# Altium project HW-FreestyleSensorLibre.PrjPcb
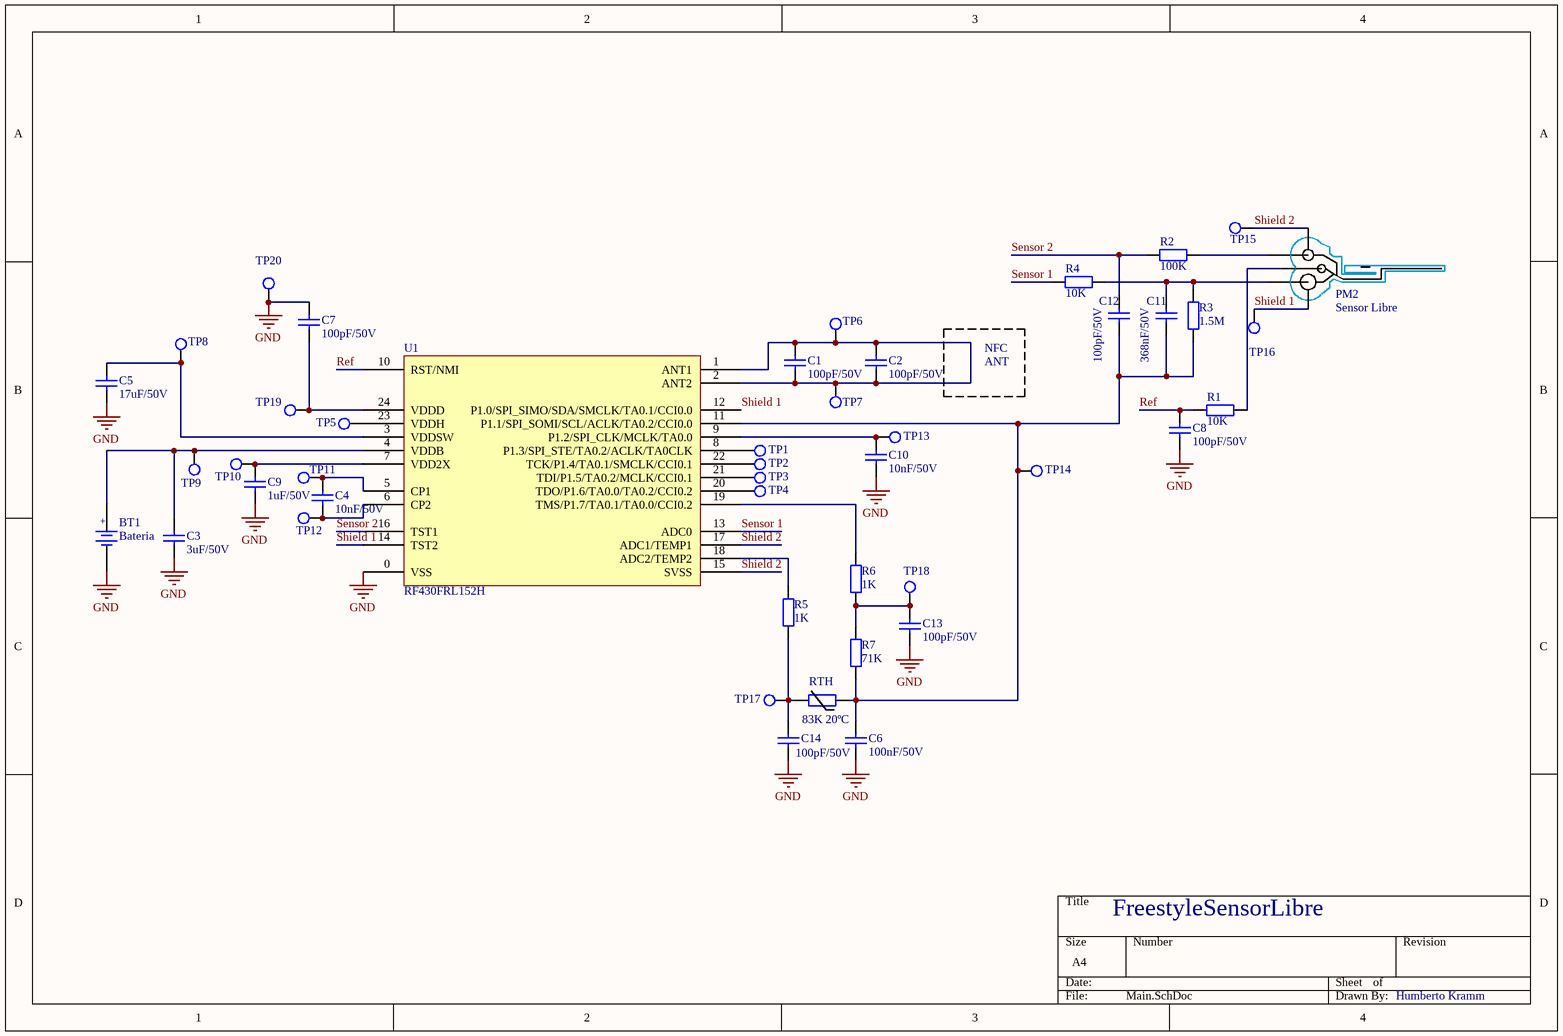
[diagram p0: Main.SchDoc]
1 sheet, 45 parts. Net scope: global (net labels, ports and power ports of the same name join across sheets).
Board file: ART23275-9 REV-A.PcbDoc

## Sheet Main.SchDoc: FreestyleSensorLibre
size A4; DrawnBy: Humberto Kramm; Engineer: Humberto Kramm

### Parts
BT1  Bateria  [BAT - V377]
C1  value 100pF/50V  [CAP 0402 - micro]  (hidden comment: Cap.Cer. 100pF/50V SMD)
C2  value 100pF/50V  [CAP 0402 - micro]  (hidden comment: Cap.Cer. 100pF/50V SMD)
C3  value 3uF/50V  [CAP 0603 - micro]  (hidden comment: Cap.Cer. 3uF/50V SMD)
C4  value 10nF/50V  [CAP 0402 - micro]  (hidden comment: Cap.Cer. 10nF/50V SMD)
C5  value 17uF/50V  [CAP 0603 - micro]  (hidden comment: Cap.Cer. 17uF/50V SMD)
C6  value 100nF/50V  [CAP 0402 - micro]  (hidden comment: Cap.Cer. 100nF/50V SMD)
C7  value 100pF/50V  [CAP 0402 - micro]  (hidden comment: Cap.Cer. 100pF/50V SMD)
C8  value 100pF/50V  [CAP 0402 - micro]  (hidden comment: Cap.Cer. 100pF/50V SMD)
C9  value 1uF/50V  [CAP 0402 - micro]  (hidden comment: Cap.Cer. 1uF/50V SMD)
C10  value 10nF/50V  [CAP 0201 - micro]  (hidden comment: Cap.Cer. 10nF/50V SMD)
C11  value 368nF/50V  [CAP 0603 - micro]  (hidden comment: Cap.Cer. 368nF/50V SMD)
C12  value 100pF/50V  [CAP 0603 - micro]  (hidden comment: Cap.Cer. 100pF/50V SMD)
C13  value 100pF/50V  [CAP 0402 - micro]  (hidden comment: Cap.Cer. 100pF/50V SMD)
C14  value 100pF/50V  [CAP 0402 - micro]  (hidden comment: Cap.Cer. 100pF/50V SMD)
PM2  Sensor Libre  [Libre_sensor]
R1  value 10K  [RES 0201 - micro]  (hidden comment: Res 10K SMD)
R2  value 100K  [RES 0402 - micro]  (hidden comment: Res 100K SMD)
R3  value 1.5M  [RES 0603 - micro]  (hidden comment: Res 1.5M SMD)
R4  value 10K  [RES 0201 - micro]  (hidden comment: Res 10K SMD)
R5  value 1K  [RES 0201 - micro]  (hidden comment: Res 1K SMD)
R6  value 1K  [RES 0201 - micro]  (hidden comment: Res 1K SMD)
R7  value 71K  [RES 0402 - micro]  (hidden comment: Res 71K SMD)
RTH  value 83K 20ºC  [res 0805]  (hidden comment: Thermistor NTC)
TP1  Teste Point  [TestePoit_1mm]  (value not drawn)  (no BOM)
TP2  Teste Point  [TestePoit_1mm]  (value not drawn)  (no BOM)
TP3  Teste Point  [TestePoit_1mm]  (value not drawn)  (no BOM)
TP4  Teste Point  [TestePoit_1mm]  (value not drawn)  (no BOM)
TP5  Teste Point  [TestePoit_1mm]  (value not drawn)  (no BOM)
TP6  Teste Point  [TestePoit_1mm]  (value not drawn)  (no BOM)
TP7  Teste Point  [TestePoit_1mm]  (value not drawn)  (no BOM)
TP8  Teste Point  [TestePoit_1mm]  (value not drawn)  (no BOM)
TP9  Teste Point  [TestePoit_1mm]  (value not drawn)  (no BOM)
TP10  Teste Point  [TestePoit_1mm]  (value not drawn)  (no BOM)
TP11  Teste Point  [TestePoit_1mm]  (value not drawn)  (no BOM)
TP12  Teste Point  [TestePoit_1mm]  (value not drawn)  (no BOM)
TP13  Teste Point  [TestePoit_1mm]  (value not drawn)  (no BOM)
TP14  Teste Point  [TestePoit_1mm]  (value not drawn)  (no BOM)
TP15  Teste Point  [TestePoit_1mm]  (value not drawn)  (no BOM)
TP16  Teste Point  [TestePoit_1mm]  (value not drawn)  (no BOM)
TP17  Teste Point  [TestePoit_1mm]  (value not drawn)  (no BOM)
TP18  Teste Point  [TestePoit_1mm]  (value not drawn)  (no BOM)
TP19  Teste Point  [TestePoit_1mm]  (value not drawn)  (no BOM)
TP20  Teste Point  [TestePoit_1mm]  (value not drawn)  (no BOM)
U1  RF430FRL152H  [VQFN 24]

### Nets
GND: BT1.2(-) C3.1 C5.1 C6.2 C7.2 C8.1 C9.1 C10.1 C13.2 C14.2 TP20.1(A) U1.0(VSS)
Ref: C8.2 R1.1 U1.10(RST/NMI)
Sensor 1: R4.2 U1.13(ADC0)
Sensor 2: C12.1 R2.1 U1.16(TST1)
Shield 1: PM2.4 TP16.1(A) U1.12(P1.0/SPI_SIMO/SDA/SMCLK/TA0.1/CCI0.0) U1.14(TST2)
Shield 2: PM2.5 TP15.1(A) U1.15(SVSS) U1.17(ADC1/TEMP1)
NetBT1_1: BT1.1(+) C3.2 TP9.1(A) U1.4(VDDB)
NetC1_1: C1.1 C1.2 C2.1 C2.2 TP6.1(A) TP7.1(A) U1.1(ANT1) U1.2(ANT2)
NetC4_1: C4.1 TP12.1(A) U1.6(CP2)
NetC4_2: C4.2 TP11.1(A) U1.5(CP1)
NetC5_2: C5.2 TP8.1(A) U1.3(VDDSW)
NetC6_1: C6.1 C11.2 C12.2 R3.2 R7.1 RTH.1 TP14.1(A) U1.11(P1.1/SPI_SOMI/SCL/ACLK/TA0.2/CCI0.0)
NetC7_1: C7.1 TP19.1(A) U1.24(VDDD)
NetC9_2: C9.2 TP10.1(A) U1.7(VDD2X)
NetC10_2: C10.2 TP13.1(A) U1.9(P1.2/SPI_CLK/MCLK/TA0.0)
NetC11_1: C11.1 PM2.2 R3.1 R4.1
NetC13_1: C13.1 R6.1 R7.2 TP18.1(A)
NetC14_1: C14.1 R5.2 RTH.2 TP17.1(A)
NetPM2_1: PM2.1 R1.2
NetPM2_3: PM2.3 R2.2
NetR5_1: R5.1 U1.18(ADC2/TEMP2)
NetR6_2: R6.2 U1.19(TMS/P1.7/TA0.1/TA0.0/CCI0.2)
NetTP1_1: TP1.1(A) U1.8(P1.3/SPI_STE/TA0.2/ACLK/TA0CLK)
NetTP2_1: TP2.1(A) U1.22(TCK/P1.4/TA0.1/SMCLK/CCI0.1)
NetTP3_1: TP3.1(A) U1.21(TDI/P1.5/TA0.2/MCLK/CCI0.1)
NetTP4_1: TP4.1(A) U1.20(TDO/P1.6/TA0.0/TA0.2/CCI0.2)
NetTP5_1: TP5.1(A) U1.23(VDDH)

### Notes on the sheet
- NFC
- ANT

### Library data of the parts
BT1 = Soquete Bat: Suporte para bateria; Almox.Gaia: SOQUETE P/ BATERIA; Código: 7260; Published: 8-Jun-2000; LatestRevisionDate: 17-Jul-2002; Publisher: Altium Limited
C1 C2 C7 C8 C12-C14 = Cap.Cer. 150pF/50V SMD: Capacitor Cerâmico; Almox.Gaia: SMD CAPACITOR CERAMICO 150pF/50V 0805; Código: 7023; Published: 8-Jun-2000; LatestRevisionDate: 22-Mar-2011; LatestRevisionNote: Re-released for DXP Platform.; PackageReference: RAD-0.3; Publisher: Altium Limited; Supplier 1: Digi-Key; Supplier 2: Newark; Supplier 3: Mouser; Supplier Part Number 1: 478-1318-2-ND; Supplier Part Number 2: 96M1323; Supplier Part Number 3: 581-08055A151J
C3 C5 C9 = Cap.Cer. 1uF/50V SMD: Capacitor Cerâmico; Almox.Gaia: SMD CAPACITOR CERAMICO 1uF/50V 0805; Código: 7416; Published: 8-Jun-2000; LatestRevisionDate: 22-Mar-2011; LatestRevisionNote: Re-released for DXP Platform.; PackageReference: RAD-0.3; Publisher: Altium Limited; Supplier 1: Digi-Key; Supplier 2: Newark; Supplier 3: Mouser
C4 C10 = Cap.Cer. 10nF/50V SMD: Capacitor Cerâmico; Almox.Gaia: SMD CAPACITOR CERAMICO 10nF/50V 0805; Código: 7022; Published: 8-Jun-2000; LatestRevisionDate: 22-Mar-2011; LatestRevisionNote: Re-released for DXP Platform.; PackageReference: RAD-0.3; Publisher: Altium Limited; Supplier 1: Digi-Key; Supplier 2: Newark; Supplier 3: Mouser; Supplier Part Number 1: 311-1136-2-ND; Supplier Part Number 2: 96M1408; Supplier Part Number 3: 80-C0805C103J5R
C6 C11 = Cap.Cer. 100nF/50V SMD: Capacitor Cerâmico; Almox.Gaia: SMD CAPACITOR CERAMICO 100nF/50V 0805; Código: 7021; Published: 8-Jun-2000; LatestRevisionDate: 22-Mar-2011; LatestRevisionNote: Re-released for DXP Platform.; PackageReference: RAD-0.3; Publisher: Altium Limited; Supplier 1: Digi-Key; Supplier 2: Newark; Supplier 3: Mouser; Supplier Part Number 1: 1276-1007-2-ND; Supplier Part Number 2: 58Y7818; Supplier Part Number 3: 581-08055C104J
PM2 = Sensor Libre: Comentario: Peças Mecânicas; Published: 8-Jun-2000; LatestRevisionDate: 22-Mar-2011; LatestRevisionNote: Re-released for DXP Platform.; Publisher: Altium Limited; Almox.Gaia: Sensor Libre
R1 R4 = Res 10K SMD: Resistor; Almox.Gaia: SMD RESISTOR   10K 0805; Código: 004905; Published: 8-Jun-2000; LatestRevisionDate: 22-Mar-2011; LatestRevisionNote: Re-released for DXP Platform.; PackageReference: AXIAL-0.4; Publisher: Altium Limited; Supplier 1: Digi-Key; Supplier 2: Newark; Supplier 3: Mouser; Supplier Part Number 1: RMCF0805JT10K0TR-ND; Supplier Part Number 2: 65J1362; Supplier Part Number 3: 667-ERJ-6GEYJ103V
R2 = Res 100K SMD: Resistor; Almox.Gaia: SMD RESISTOR 100R 0805; Código: 7420; Published: 8-Jun-2000; LatestRevisionDate: 22-Mar-2011; LatestRevisionNote: Re-released for DXP Platform.; PackageReference: AXIAL-0.4; Publisher: Altium Limited; Supplier 1: Digi-Key; Supplier 2: Newark; Supplier 3: Mouser; Supplier Part Number 1: RMCF0805JT100RTR-ND; Supplier Part Number 2: 79M6015; Supplier Part Number 3: 71-CRCW0805-100-E3
R3 = Res 2M SMD: Resistor; Almox.Gaia: SMD RESISTOR    2M 0805; Código: 005147; Published: 8-Jun-2000; LatestRevisionDate: 22-Mar-2011; LatestRevisionNote: Re-released for DXP Platform.; PackageReference: AXIAL-0.4; Publisher: Altium Limited; Supplier 1: Digi-Key; Supplier 2: Newark; Supplier 3: Mouser; Supplier Part Number 1: P2.0MACT-ND; Supplier Part Number 2: 59M6868; Supplier Part Number 3: 667-ERJ-U06J205V
R5 R6 = Res 1K SMD: Resistor; Almox.Gaia: SMD RESISTOR    1K 0805; Código: 004903; Published: 8-Jun-2000; LatestRevisionDate: 22-Mar-2011; LatestRevisionNote: Re-released for DXP Platform.; PackageReference: AXIAL-0.4; Publisher: Altium Limited; Supplier 1: Digi-Key; Supplier 2: Newark; Supplier 3: Mouser; Supplier Part Number 1: P1.00KCCT-ND; Supplier Part Number 2: 65J1337; Supplier Part Number 3: 667-ERJ-6GEYJ102V
R7 = Res 68K SMD: Resistor; Almox.Gaia: SMD RESISTOR 68K 0805; Código: 005139; Published: 8-Jun-2000; LatestRevisionDate: 22-Mar-2011; LatestRevisionNote: Re-released for DXP Platform.; PackageReference: AXIAL-0.4; Publisher: Altium Limited; Supplier 1: Digi-Key; Supplier 2: Newark; Supplier 3: Mouser; Supplier Part Number 1: RMCF0805JT68K0TR-ND; Supplier Part Number 2: 58K4893; Supplier Part Number 3: 652-CR0805JW-683ELF
RTH = Thermistor NTC: Thermistor; Published: 8-Jun-2000; LatestRevisionDate: 22-Mar-2011; LatestRevisionNote: Re-released for DXP Platform.; PackageReference: AXIAL-0.4; Publisher: Altium Limited; Almox.Gaia: THERMISTOR NTC
U1 = RF430FRL152H: NFC ISO15693 Sensor Transponder With SPI/I2C Interface and 14-Bit Sigma-Delta ADC; Note: The CCP1 pin is determined by CCPMX in Configuration Word 1 register.; ComponentLink1Description: Manufacturer URL; ComponentLink2Description: Datasheet; ComponentLink3Description: Package Specification; Almox.Gaia: RF430FRL152H; Observação: *
TP1-TP20 = Teste Point: Published: 24-Mar-1999; LatestRevisionDate: 17-Jul-2002; LatestRevisionNote: Re-released for DXP Platform.; PackageReference: PIN1; Publisher: Altium Limited